# EAGLE schematic tkl3 (EAGLE 9.5.2)
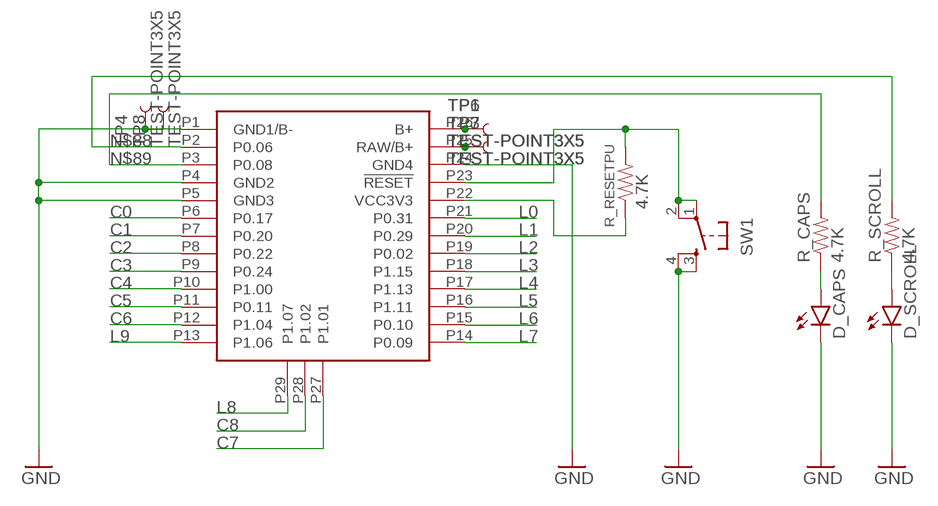
[diagram p0: schematic, sheet 1, part 1 of 2]
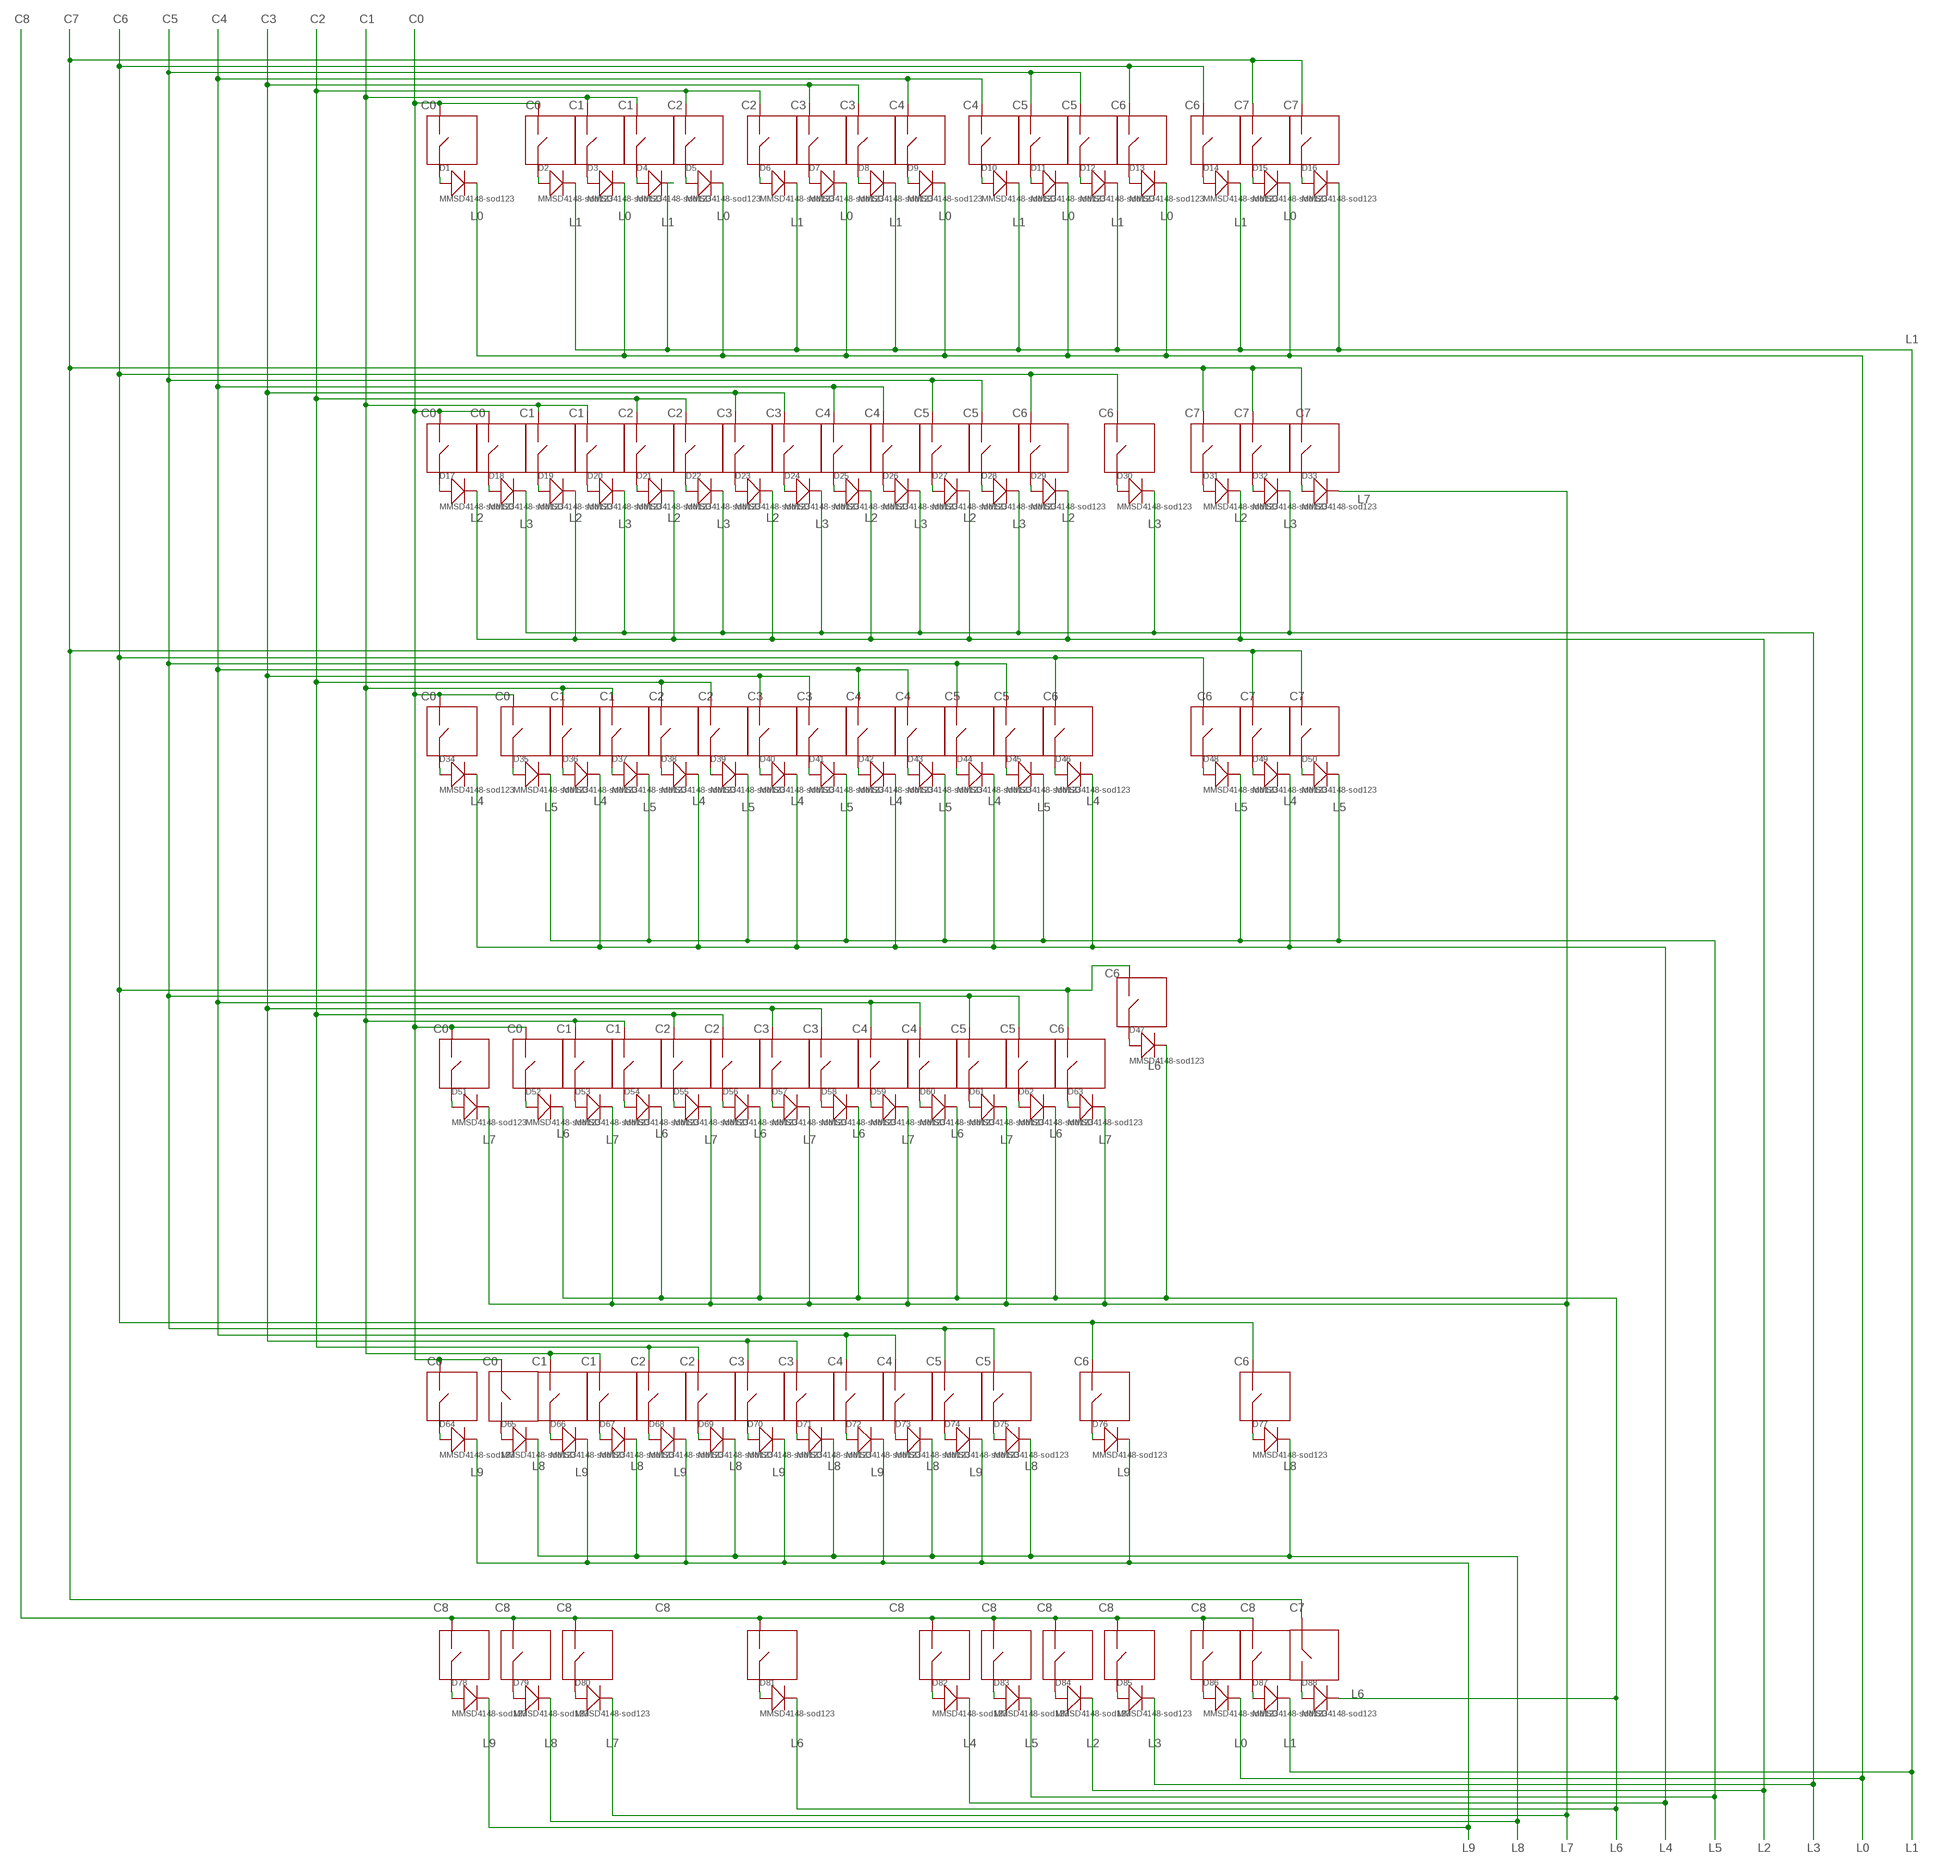
[diagram p1: schematic, sheet 1, part 2 of 2]

## Parts
D1  MMSD4148-sod123  SMD-DIODE-100V-200MA(SOD-123)  [SOD-123]
D2  MMSD4148-sod123  SMD-DIODE-100V-200MA(SOD-123)  [SOD-123]
D3  MMSD4148-sod123  SMD-DIODE-100V-200MA(SOD-123)  [SOD-123]
D4  MMSD4148-sod123  SMD-DIODE-100V-200MA(SOD-123)  [SOD-123]
D5  MMSD4148-sod123  SMD-DIODE-100V-200MA(SOD-123)  [SOD-123]
D6  MMSD4148-sod123  SMD-DIODE-100V-200MA(SOD-123)  [SOD-123]
D7  MMSD4148-sod123  SMD-DIODE-100V-200MA(SOD-123)  [SOD-123]
D8  MMSD4148-sod123  SMD-DIODE-100V-200MA(SOD-123)  [SOD-123]
D9  MMSD4148-sod123  SMD-DIODE-100V-200MA(SOD-123)  [SOD-123]
D10  MMSD4148-sod123  SMD-DIODE-100V-200MA(SOD-123)  [SOD-123]
D11  MMSD4148-sod123  SMD-DIODE-100V-200MA(SOD-123)  [SOD-123]
D12  MMSD4148-sod123  SMD-DIODE-100V-200MA(SOD-123)  [SOD-123]
D13  MMSD4148-sod123  SMD-DIODE-100V-200MA(SOD-123)  [SOD-123]
D14  MMSD4148-sod123  SMD-DIODE-100V-200MA(SOD-123)  [SOD-123]
D15  MMSD4148-sod123  SMD-DIODE-100V-200MA(SOD-123)  [SOD-123]
D16  MMSD4148-sod123  SMD-DIODE-100V-200MA(SOD-123)  [SOD-123]
D17  MMSD4148-sod123  SMD-DIODE-100V-200MA(SOD-123)  [SOD-123]
D18  MMSD4148-sod123  SMD-DIODE-100V-200MA(SOD-123)  [SOD-123]
D19  MMSD4148-sod123  SMD-DIODE-100V-200MA(SOD-123)  [SOD-123]
D20  MMSD4148-sod123  SMD-DIODE-100V-200MA(SOD-123)  [SOD-123]
D21  MMSD4148-sod123  SMD-DIODE-100V-200MA(SOD-123)  [SOD-123]
D22  MMSD4148-sod123  SMD-DIODE-100V-200MA(SOD-123)  [SOD-123]
D23  MMSD4148-sod123  SMD-DIODE-100V-200MA(SOD-123)  [SOD-123]
D24  MMSD4148-sod123  SMD-DIODE-100V-200MA(SOD-123)  [SOD-123]
D25  MMSD4148-sod123  SMD-DIODE-100V-200MA(SOD-123)  [SOD-123]
D26  MMSD4148-sod123  SMD-DIODE-100V-200MA(SOD-123)  [SOD-123]
D27  MMSD4148-sod123  SMD-DIODE-100V-200MA(SOD-123)  [SOD-123]
D28  MMSD4148-sod123  SMD-DIODE-100V-200MA(SOD-123)  [SOD-123]
D29  MMSD4148-sod123  SMD-DIODE-100V-200MA(SOD-123)  [SOD-123]
D30  MMSD4148-sod123  SMD-DIODE-100V-200MA(SOD-123)  [SOD-123]
D31  MMSD4148-sod123  SMD-DIODE-100V-200MA(SOD-123)  [SOD-123]
D32  MMSD4148-sod123  SMD-DIODE-100V-200MA(SOD-123)  [SOD-123]
D33  MMSD4148-sod123  SMD-DIODE-100V-200MA(SOD-123)  [SOD-123]
D34  MMSD4148-sod123  SMD-DIODE-100V-200MA(SOD-123)  [SOD-123]
D35  MMSD4148-sod123  SMD-DIODE-100V-200MA(SOD-123)  [SOD-123]
D36  MMSD4148-sod123  SMD-DIODE-100V-200MA(SOD-123)  [SOD-123]
D37  MMSD4148-sod123  SMD-DIODE-100V-200MA(SOD-123)  [SOD-123]
D38  MMSD4148-sod123  SMD-DIODE-100V-200MA(SOD-123)  [SOD-123]
D39  MMSD4148-sod123  SMD-DIODE-100V-200MA(SOD-123)  [SOD-123]
D40  MMSD4148-sod123  SMD-DIODE-100V-200MA(SOD-123)  [SOD-123]
D41  MMSD4148-sod123  SMD-DIODE-100V-200MA(SOD-123)  [SOD-123]
D42  MMSD4148-sod123  SMD-DIODE-100V-200MA(SOD-123)  [SOD-123]
D43  MMSD4148-sod123  SMD-DIODE-100V-200MA(SOD-123)  [SOD-123]
D44  MMSD4148-sod123  SMD-DIODE-100V-200MA(SOD-123)  [SOD-123]
D45  MMSD4148-sod123  SMD-DIODE-100V-200MA(SOD-123)  [SOD-123]
D46  MMSD4148-sod123  SMD-DIODE-100V-200MA(SOD-123)  [SOD-123]
D47  MMSD4148-sod123  SMD-DIODE-100V-200MA(SOD-123)  [SOD-123]
D48  MMSD4148-sod123  SMD-DIODE-100V-200MA(SOD-123)  [SOD-123]
D49  MMSD4148-sod123  SMD-DIODE-100V-200MA(SOD-123)  [SOD-123]
D50  MMSD4148-sod123  SMD-DIODE-100V-200MA(SOD-123)  [SOD-123]
D51  MMSD4148-sod123  SMD-DIODE-100V-200MA(SOD-123)  [SOD-123]
D52  MMSD4148-sod123  SMD-DIODE-100V-200MA(SOD-123)  [SOD-123]
D53  MMSD4148-sod123  SMD-DIODE-100V-200MA(SOD-123)  [SOD-123]
D54  MMSD4148-sod123  SMD-DIODE-100V-200MA(SOD-123)  [SOD-123]
D55  MMSD4148-sod123  SMD-DIODE-100V-200MA(SOD-123)  [SOD-123]
D56  MMSD4148-sod123  SMD-DIODE-100V-200MA(SOD-123)  [SOD-123]
D57  MMSD4148-sod123  SMD-DIODE-100V-200MA(SOD-123)  [SOD-123]
D58  MMSD4148-sod123  SMD-DIODE-100V-200MA(SOD-123)  [SOD-123]
D59  MMSD4148-sod123  SMD-DIODE-100V-200MA(SOD-123)  [SOD-123]
D60  MMSD4148-sod123  SMD-DIODE-100V-200MA(SOD-123)  [SOD-123]
D61  MMSD4148-sod123  SMD-DIODE-100V-200MA(SOD-123)  [SOD-123]
D62  MMSD4148-sod123  SMD-DIODE-100V-200MA(SOD-123)  [SOD-123]
D63  MMSD4148-sod123  SMD-DIODE-100V-200MA(SOD-123)  [SOD-123]
D64  MMSD4148-sod123  SMD-DIODE-100V-200MA(SOD-123)  [SOD-123]
D65  MMSD4148-sod123  SMD-DIODE-100V-200MA(SOD-123)  [SOD-123]
D66  MMSD4148-sod123  SMD-DIODE-100V-200MA(SOD-123)  [SOD-123]
D67  MMSD4148-sod123  SMD-DIODE-100V-200MA(SOD-123)  [SOD-123]
D68  MMSD4148-sod123  SMD-DIODE-100V-200MA(SOD-123)  [SOD-123]
D69  MMSD4148-sod123  SMD-DIODE-100V-200MA(SOD-123)  [SOD-123]
D70  MMSD4148-sod123  SMD-DIODE-100V-200MA(SOD-123)  [SOD-123]
D71  MMSD4148-sod123  SMD-DIODE-100V-200MA(SOD-123)  [SOD-123]
D72  MMSD4148-sod123  SMD-DIODE-100V-200MA(SOD-123)  [SOD-123]
D73  MMSD4148-sod123  SMD-DIODE-100V-200MA(SOD-123)  [SOD-123]
D74  MMSD4148-sod123  SMD-DIODE-100V-200MA(SOD-123)  [SOD-123]
D75  MMSD4148-sod123  SMD-DIODE-100V-200MA(SOD-123)  [SOD-123]
D76  MMSD4148-sod123  SMD-DIODE-100V-200MA(SOD-123)  [SOD-123]
D77  MMSD4148-sod123  SMD-DIODE-100V-200MA(SOD-123)  [SOD-123]
D78  MMSD4148-sod123  SMD-DIODE-100V-200MA(SOD-123)  [SOD-123]
D79  MMSD4148-sod123  SMD-DIODE-100V-200MA(SOD-123)  [SOD-123]
D80  MMSD4148-sod123  SMD-DIODE-100V-200MA(SOD-123)  [SOD-123]
D81  MMSD4148-sod123  SMD-DIODE-100V-200MA(SOD-123)  [SOD-123]
D82  MMSD4148-sod123  SMD-DIODE-100V-200MA(SOD-123)  [SOD-123]
D83  MMSD4148-sod123  SMD-DIODE-100V-200MA(SOD-123)  [SOD-123]
D84  MMSD4148-sod123  SMD-DIODE-100V-200MA(SOD-123)  [SOD-123]
D85  MMSD4148-sod123  SMD-DIODE-100V-200MA(SOD-123)  [SOD-123]
D86  MMSD4148-sod123  SMD-DIODE-100V-200MA(SOD-123)  [SOD-123]
D87  MMSD4148-sod123  SMD-DIODE-100V-200MA(SOD-123)  [SOD-123]
D88  MMSD4148-sod123  SMD-DIODE-100V-200MA(SOD-123)  [SOD-123]
D_CAPS  LED3MM  [LED3MM]
D_SCROLL  LED3MM  [LED3MM]
F_F2  CHERRY_MX1U  [CHERRY_MX_NO_LED_SOCKET_1U]
K_0  CHERRY_MX1U  [CHERRY_MX_NO_LED_SOCKET_1U]
K_1  CHERRY_MX1U  [CHERRY_MX_NO_LED_SOCKET_1U]
K_2  CHERRY_MX1U  [CHERRY_MX_NO_LED_SOCKET_1U]
K_3  CHERRY_MX1U  [CHERRY_MX_NO_LED_SOCKET_1U]
K_4  CHERRY_MX1U  [CHERRY_MX_NO_LED_SOCKET_1U]
K_5  CHERRY_MX1U  [CHERRY_MX_NO_LED_SOCKET_1U]
K_6  CHERRY_MX1U  [CHERRY_MX_NO_LED_SOCKET_1U]
K_7  CHERRY_MX1U  [CHERRY_MX_NO_LED_SOCKET_1U]
K_8  CHERRY_MX1U  [CHERRY_MX_NO_LED_SOCKET_1U]
K_9  CHERRY_MX1U  [CHERRY_MX_NO_LED_SOCKET_1U]
K_A  CHERRY_MX1U  [CHERRY_MX_NO_LED_SOCKET_1U]
K_B  CHERRY_MX1U  [CHERRY_MX_NO_LED_SOCKET_1U]
K_BACK  CHERRY_MX1U  [CHERRY_MX_NO_LED_SOCKET_1U]
K_C  CHERRY_MX1U  [CHERRY_MX_NO_LED_SOCKET_1U]
K_CAPSLOCK  CHERRY_MX1U  [CHERRY_MX_NO_LED_SOCKET_1U]
K_COMA  CHERRY_MX1U  [CHERRY_MX_NO_LED_SOCKET_1U]
K_D  CHERRY_MX1U  [CHERRY_MX_NO_LED_SOCKET_1U]
K_DELETE  CHERRY_MX1U  [CHERRY_MX_NO_LED_SOCKET_1U]
K_DOT  CHERRY_MX1U  [CHERRY_MX_NO_LED_SOCKET_1U]
K_DOWN  CHERRY_MX1U  [CHERRY_MX_NO_LED_SOCKET_1U]
K_E  CHERRY_MX1U  [CHERRY_MX_NO_LED_SOCKET_1U]
K_ECH  CHERRY_MX1U  [CHERRY_MX_NO_LED_SOCKET_1U]
K_END  CHERRY_MX1U  [CHERRY_MX_NO_LED_SOCKET_1U]
K_ENTER  CHERRY_MX1U  [CHERRY_MX_NO_LED_SOCKET_1U]
K_F  CHERRY_MX1U  [CHERRY_MX_NO_LED_SOCKET_1U]
K_F1  CHERRY_MX1U  [CHERRY_MX_NO_LED_SOCKET_1U]
K_F3  CHERRY_MX1U  [CHERRY_MX_NO_LED_SOCKET_1U]
K_F4  CHERRY_MX1U  [CHERRY_MX_NO_LED_SOCKET_1U]
K_F5  CHERRY_MX1U  [CHERRY_MX_NO_LED_SOCKET_1U]
K_F6  CHERRY_MX1U  [CHERRY_MX_NO_LED_SOCKET_1U]
K_F7  CHERRY_MX1U  [CHERRY_MX_NO_LED_SOCKET_1U]
K_F8  CHERRY_MX1U  [CHERRY_MX_NO_LED_SOCKET_1U]
K_F9  CHERRY_MX1U  [CHERRY_MX_NO_LED_SOCKET_1U]
K_F10  CHERRY_MX1U  [CHERRY_MX_NO_LED_SOCKET_1U]
K_F11  CHERRY_MX1U  [CHERRY_MX_NO_LED_SOCKET_1U]
K_F12  CHERRY_MX1U  [CHERRY_MX_NO_LED_SOCKET_1U]
K_FN  CHERRY_MX1U  [CHERRY_MX_NO_LED_SOCKET_1U]
K_G  CHERRY_MX1U  [CHERRY_MX_NO_LED_SOCKET_1U]
K_H  CHERRY_MX1U  [CHERRY_MX_NO_LED_SOCKET_1U]
K_HOME  CHERRY_MX1U  [CHERRY_MX_NO_LED_SOCKET_1U]
K_I  CHERRY_MX1U  [CHERRY_MX_NO_LED_SOCKET_1U]
K_INSERT  CHERRY_MX1U  [CHERRY_MX_NO_LED_SOCKET_1U]
K_J  CHERRY_MX1U  [CHERRY_MX_NO_LED_SOCKET_1U]
K_K  CHERRY_MX1U  [CHERRY_MX_NO_LED_SOCKET_1U]
K_L  CHERRY_MX1U  [CHERRY_MX_NO_LED_SOCKET_1U]
K_LALT  CHERRY_MX1U  [CHERRY_MX_NO_LED_SOCKET_1U]
K_LBRA  CHERRY_MX1U  [CHERRY_MX_NO_LED_SOCKET_1U]
K_LCTRL  CHERRY_MX1U  [CHERRY_MX_NO_LED_SOCKET_1U]
K_LEFT  CHERRY_MX1U  [CHERRY_MX_NO_LED_SOCKET_1U]
K_LSHFT  CHERRY_MX1U  [CHERRY_MX_NO_LED_SOCKET_1U]
K_LWIN  CHERRY_MX1U  [CHERRY_MX_NO_LED_SOCKET_1U]
K_M  CHERRY_MX1U  [CHERRY_MX_NO_LED_SOCKET_1U]
K_MINUS  CHERRY_MX1U  [CHERRY_MX_NO_LED_SOCKET_1U]
K_N  CHERRY_MX1U  [CHERRY_MX_NO_LED_SOCKET_1U]
K_O  CHERRY_MX1U  [CHERRY_MX_NO_LED_SOCKET_1U]
K_P  CHERRY_MX1U  [CHERRY_MX_NO_LED_SOCKET_1U]
K_PAUSE  CHERRY_MX1U  [CHERRY_MX_NO_LED_SOCKET_1U]
K_PDW  CHERRY_MX1U  [CHERRY_MX_NO_LED_SOCKET_1U]
K_PIPE  CHERRY_MX1U  [CHERRY_MX_NO_LED_SOCKET_1U]
K_PLUS  CHERRY_MX1U  [CHERRY_MX_NO_LED_SOCKET_1U]
K_PRNT  CHERRY_MX1U  [CHERRY_MX_NO_LED_SOCKET_1U]
K_PUP  CHERRY_MX1U  [CHERRY_MX_NO_LED_SOCKET_1U]
K_Q  CHERRY_MX1U  [CHERRY_MX_NO_LED_SOCKET_1U]
K_QUOTE  CHERRY_MX1U  [CHERRY_MX_NO_LED_SOCKET_1U]
K_R  CHERRY_MX1U  [CHERRY_MX_NO_LED_SOCKET_1U]
K_RALT  CHERRY_MX1U  [CHERRY_MX_NO_LED_SOCKET_1U]
K_RBRA  CHERRY_MX1U  [CHERRY_MX_NO_LED_SOCKET_1U]
K_RCTRL  CHERRY_MX1U  [CHERRY_MX_NO_LED_SOCKET_1U]
K_RIGHT  CHERRY_MX1U  [CHERRY_MX_NO_LED_SOCKET_1U]
K_RSHFT  CHERRY_MX1U  [CHERRY_MX_NO_LED_SOCKET_1U]
K_RWIN  CHERRY_MX1U  [CHERRY_MX_NO_LED_SOCKET_1U]
K_S  CHERRY_MX1U  [CHERRY_MX_NO_LED_SOCKET_1U]
K_SCROL  CHERRY_MX1U  [CHERRY_MX_NO_LED_SOCKET_1U]
K_SEMIC  CHERRY_MX1U  [CHERRY_MX_NO_LED_SOCKET_1U]
K_SLASH  CHERRY_MX1U  [CHERRY_MX_NO_LED_SOCKET_1U]
K_SPACE  CHERRY_MX1U  [CHERRY_MX_NO_LED_SOCKET_1U]
K_T  CHERRY_MX1U  [CHERRY_MX_NO_LED_SOCKET_1U]
K_TAB  CHERRY_MX1U  [CHERRY_MX_NO_LED_SOCKET_1U]
K_U  CHERRY_MX1U  [CHERRY_MX_NO_LED_SOCKET_1U]
K_UP  CHERRY_MX1U  [CHERRY_MX_NO_LED_SOCKET_1U]
K_V  CHERRY_MX1U  [CHERRY_MX_NO_LED_SOCKET_1U]
K_W  CHERRY_MX1U  [CHERRY_MX_NO_LED_SOCKET_1U]
K_WAVE  CHERRY_MX1U  [CHERRY_MX_NO_LED_SOCKET_1U]
K_X  CHERRY_MX1U  [CHERRY_MX_NO_LED_SOCKET_1U]
K_Y  CHERRY_MX1U  [CHERRY_MX_NO_LED_SOCKET_1U]
K_Z  CHERRY_MX1U  [CHERRY_MX_NO_LED_SOCKET_1U]
R_CAPS  4.7K  4.7KOHM-1/10W-1%(0603)  [0603-RES]
R_RESETPU  4.7K  4.7KOHM-1/10W-1%(0603)  [0603-RES]
R_SCROLL  4.7K  4.7KOHM-1/10W-1%(0603)  [0603-RES]
SW1  SWITCH_SPST_4_PINRECT  [TACTILE_SWITCH_SMD_4.6X2.8MM]
TP1  TEST-POINT3X5  [PAD.03X.05]
TP3  TEST-POINT3X5  [PAD.03X.05]
TP4  TEST-POINT3X5  [PAD.03X.05]
TP6  TEST-POINT3X5  [PAD.03X.05]
TP7  TEST-POINT3X5  [PAD.03X.05]
TP8  TEST-POINT3X5  [PAD.03X.05]
U$1  NICE_NANO  [NICE_NANO]
Κ_GRV  CHERRY_MX1U  [CHERRY_MX_NO_LED_SOCKET_1U]

## Nets
C0: K_1.PIN2 K_A.PIN2 K_CAPSLOCK.PIN2 K_ECH.PIN2 K_F1.PIN2 K_LSHFT.PIN2 K_PIPE.PIN1 K_Q.PIN2 K_TAB.PIN2 U$1.P6(P0.17) Κ_GRV.PIN2
C1: F_F2.PIN2 K_2.PIN2 K_3.PIN2 K_D.PIN2 K_E.PIN2 K_F3.PIN2 K_S.PIN2 K_W.PIN2 K_X.PIN2 K_Z.PIN2 U$1.P7(P0.20)
C2: K_4.PIN2 K_5.PIN2 K_C.PIN2 K_F4.PIN2 K_F5.PIN2 K_F.PIN2 K_G.PIN2 K_R.PIN2 K_T.PIN2 K_V.PIN2 U$1.P8(P0.22)
C3: K_6.PIN2 K_7.PIN2 K_B.PIN2 K_F6.PIN2 K_F7.PIN2 K_H.PIN2 K_J.PIN2 K_N.PIN2 K_U.PIN2 K_Y.PIN2 U$1.P9(P0.24)
C4: K_8.PIN2 K_9.PIN2 K_COMA.PIN2 K_F8.PIN2 K_F9.PIN2 K_I.PIN2 K_K.PIN2 K_L.PIN2 K_M.PIN2 K_O.PIN2 U$1.P10(P1.00)
C5: K_0.PIN2 K_DOT.PIN2 K_F10.PIN2 K_F11.PIN2 K_LBRA.PIN2 K_MINUS.PIN2 K_P.PIN2 K_QUOTE.PIN2 K_SEMIC.PIN2 K_SLASH.PIN2 U$1.P11(P0.11)
C6: K_BACK.PIN2 K_DELETE.PIN2 K_ENTER.PIN2 K_F12.PIN2 K_PLUS.PIN2 K_PRNT.PIN2 K_RBRA.PIN2 K_RSHFT.PIN2 K_UP.PIN2 K_WAVE.PIN2 U$1.P12(P1.04)
C7: K_END.PIN2 K_HOME.PIN2 K_INSERT.PIN2 K_PAUSE.PIN2 K_PDW.PIN2 K_PUP.PIN2 K_RIGHT.PIN1 K_SCROL.PIN2 U$1.P27(P1.01)
C8: K_DOWN.PIN2 K_FN.PIN2 K_LALT.PIN2 K_LCTRL.PIN2 K_LEFT.PIN2 K_LWIN.PIN2 K_RALT.PIN2 K_RCTRL.PIN2 K_RWIN.PIN2 K_SPACE.PIN2 U$1.P28(P1.02)
GND: D_CAPS.K(C) D_SCROLL.K(C) SW1.3 SW1.4 TP4.P$1 TP8.P$1 U$1.P1(GND1/B-) U$1.P4(GND2) U$1.P5(GND3) U$1.P24(GND4)
L0: D1.- D3.- D5.- D7.- D9.- D11.- D13.- D15.- D86.- U$1.P21(P0.31)
L1: D2.- D4.- D6.- D8.- D10.- D12.- D14.- D16.- D87.- U$1.P20(P0.29)
L2: D17.- D19.- D21.- D23.- D25.- D27.- D29.- D31.- D84.- U$1.P19(P0.02)
L3: D18.- D20.- D22.- D24.- D26.- D28.- D30.- D32.- D85.- U$1.P18(P1.15)
L4: D34.- D36.- D38.- D40.- D42.- D44.- D46.- D49.- D82.- U$1.P17(P1.13)
L5: D35.- D37.- D39.- D41.- D43.- D45.- D48.- D50.- D83.- U$1.P16(P1.11)
L6: D47.- D52.- D54.- D56.- D58.- D60.- D62.- D81.- D88.- U$1.P15(P0.10)
L7: D33.- D51.- D53.- D55.- D57.- D59.- D61.- D63.- D80.- U$1.P14(P0.09)
L8: D65.- D67.- D69.- D71.- D73.- D75.- D77.- D79.- U$1.P29(P1.07)
L9: D64.- D66.- D68.- D70.- D72.- D74.- D76.- D78.- U$1.P13(P1.06)
N$1: D88.+ K_RIGHT.PIN2
N$2: D1.+ K_ECH.PIN1
N$3: D2.+ K_F1.PIN1
N$4: D3.+ F_F2.PIN1
N$5: D4.+ K_F3.PIN1
N$6: D5.+ K_F4.PIN1
N$7: D6.+ K_F5.PIN1
N$8: D7.+ K_F6.PIN1
N$9: D8.+ K_F7.PIN1
N$10: D9.+ K_F8.PIN1
N$11: D10.+ K_F9.PIN1
N$12: D11.+ K_F10.PIN1
N$13: D12.+ K_F11.PIN1
N$14: D13.+ K_F12.PIN1
N$15: D14.+ K_PRNT.PIN1
N$16: D15.+ K_SCROL.PIN1
N$17: D16.+ K_PAUSE.PIN1
N$18: D33.+ K_PUP.PIN1
N$19: D32.+ K_HOME.PIN1
N$20: D31.+ K_INSERT.PIN1
N$21: D30.+ K_BACK.PIN1
N$22: D29.+ K_PLUS.PIN1
N$23: D28.+ K_MINUS.PIN1
N$24: D27.+ K_0.PIN1
N$25: D26.+ K_9.PIN1
N$26: D25.+ K_8.PIN1
N$27: D24.+ K_7.PIN1
N$28: D23.+ K_6.PIN1
N$29: D22.+ K_5.PIN1
N$30: D21.+ K_4.PIN1
N$31: D20.+ K_3.PIN1
N$32: D19.+ K_2.PIN1
N$33: D18.+ K_1.PIN1
N$34: D17.+ Κ_GRV.PIN1
N$35: D34.+ K_TAB.PIN1
N$36: D35.+ K_Q.PIN1
N$37: D36.+ K_W.PIN1
N$38: D37.+ K_E.PIN1
N$39: D38.+ K_R.PIN1
N$40: D39.+ K_T.PIN1
N$41: D40.+ K_Y.PIN1
N$42: D41.+ K_U.PIN1
N$43: D42.+ K_I.PIN1
N$44: D43.+ K_O.PIN1
N$45: D44.+ K_P.PIN1
N$46: D45.+ K_LBRA.PIN1
N$47: D46.+ K_RBRA.PIN1
N$48: D47.+ K_ENTER.PIN1
N$49: D48.+ K_DELETE.PIN1
N$50: D49.+ K_END.PIN1
N$51: D50.+ K_PDW.PIN1
N$52: D51.+ K_CAPSLOCK.PIN1
N$53: D52.+ K_A.PIN1
N$54: D53.+ K_S.PIN1
N$55: D54.+ K_D.PIN1
N$56: D55.+ K_F.PIN1
N$57: D56.+ K_G.PIN1
N$58: D57.+ K_H.PIN1
N$59: D58.+ K_J.PIN1
N$60: D59.+ K_K.PIN1
N$61: D60.+ K_L.PIN1
N$62: D61.+ K_SEMIC.PIN1
N$63: D62.+ K_QUOTE.PIN1
N$64: D63.+ K_WAVE.PIN1
N$65: D64.+ K_LSHFT.PIN1
N$66: D65.+ K_PIPE.PIN2
N$67: D66.+ K_Z.PIN1
N$68: D67.+ K_X.PIN1
N$69: D68.+ K_C.PIN1
N$70: D69.+ K_V.PIN1
N$71: D70.+ K_B.PIN1
N$72: D71.+ K_N.PIN1
N$73: D72.+ K_M.PIN1
N$74: D73.+ K_COMA.PIN1
N$75: D74.+ K_DOT.PIN1
N$76: D75.+ K_SLASH.PIN1
N$77: D76.+ K_RSHFT.PIN1
N$78: D77.+ K_UP.PIN1
N$79: D78.+ K_LCTRL.PIN1
N$80: D79.+ K_LWIN.PIN1
N$81: D82.+ K_RALT.PIN1
N$82: D81.+ K_SPACE.PIN1
N$83: D83.+ K_RWIN.PIN1
N$84: D84.+ K_RCTRL.PIN1
N$85: D85.+ K_FN.PIN1
N$86: D86.+ K_LEFT.PIN1
N$87: D87.+ K_DOWN.PIN1
N$88: R_CAPS.2 U$1.P3(P0.08)
N$89: R_SCROLL.2 U$1.P2(P0.06)
N$90: D_CAPS.A R_CAPS.1
N$91: D_SCROLL.A R_SCROLL.1
N$92: R_RESETPU.2 SW1.1 SW1.2 U$1.P23(!RESET)
N$93: R_RESETPU.1 U$1.P22(VCC3V3)
N$95: TP1.P$1 TP6.P$1 U$1.P26(B+)
N$96: TP3.P$1 TP7.P$1 U$1.P25(RAW/B+)
N$102: D80.+ K_LALT.PIN1

## Library data of the parts
D1-D88 = OPL_Discrete_Semiconductor:SMD-DIODE-100V-200MA(SOD-123): 304010007; MPN: MMSD4148
D_CAPS D_SCROLL = SparkFun-LED:LED: LEDs Standard schematic elements and footprints for 5mm, 3mm, 1206, and 0603 sized LEDs. 5mm - Spark Fun Electronics SKU : COM-00529 (and others); PROD_ID: DIO-08794
F_F2 K_0 K_1-K_9 K_A K_B K_BACK K_C K_CAPSLOCK K_COMA K_D K_DELETE K_DOT K_DOWN K_E K_ECH K_END K_ENTER K_F K_F1 K_F3-K_F12 K_FN K_G K_H K_HOME K_I K_INSERT K_J K_K K_L K_LALT K_LBRA K_LCTRL K_LEFT K_LSHFT K_LWIN K_M K_MINUS K_N K_O K_P K_PAUSE K_PDW K_PIPE K_PLUS K_PRNT K_PUP K_Q K_QUOTE K_R K_RALT K_RBRA K_RCTRL K_RIGHT K_RSHFT K_RWIN K_S K_SCROL K_SEMIC K_SLASH K_SPACE K_T K_TAB K_U K_UP K_V K_W K_WAVE K_X K_Y K_Z Κ_GRV = SY_SWITCHES:CHERRY_MX
R_CAPS R_RESETPU R_SCROLL = SparkFun-Resistors:4.7KOHM-1/10W-1%(0603): RES-07857; PROD_ID: RES-07857
SW1 = SparkFun-Electromechanical:SWITCH_SPST_4_PIN; PROD_ID: SWCH-13065
TP1 TP3 TP4 TP6-TP8 = SparkFun-Passives:TEST-POINT: Bare copper test points for troubleshooting or ICT
U$1 = nice_nano:NICE_NANO

## Net classes
0 default: width 0.152 mm, drill 0.305 mm, clearance 0.152 mm
2 gnd: width 0.254 mm, drill 0.584 mm, clearance 0.203 mm